# Altium schematic sheet MicroSwitch.SchDoc
size A4
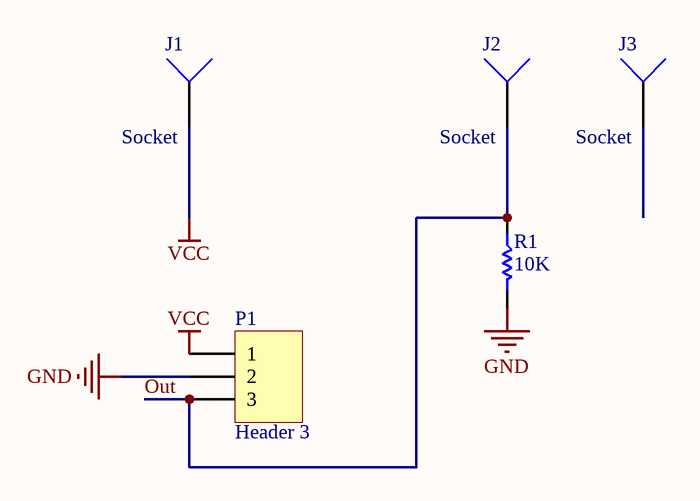
[diagram p0: MicroSwitch.SchDoc]

## Parts
J1  Socket  [PIN1]
J2  Socket  [PIN1]
J3  Socket  [PIN1]
P1  Header 3  [HDR1X3]
R1  10K  [6-0805_L]

## Nets
GND: P1.2 R1.2
VCC: J1.1 P1.1
Out: J2.1 P1.3 R1.1

Not connected (* = marked no-connect by the designer): J3 1

## Notes on the sheet
- Title
- Size:
- Date:
- A4
- Number:
- Time:
- Revision:
- Sheet
- of
- File:

## Library data of the parts
P1 = Header 3: Header, 3-Pin; LatestRevisionDate: 17-Jul-2002; LatestRevisionNote: Re-released for DXP Platform.; Publisher: Altium Limited
R1 = RESISTOR
J1-J3 = Socket: LatestRevisionDate: 17-Jul-2002; LatestRevisionNote: Re-released for DXP Platform.; Publisher: Altium Limited